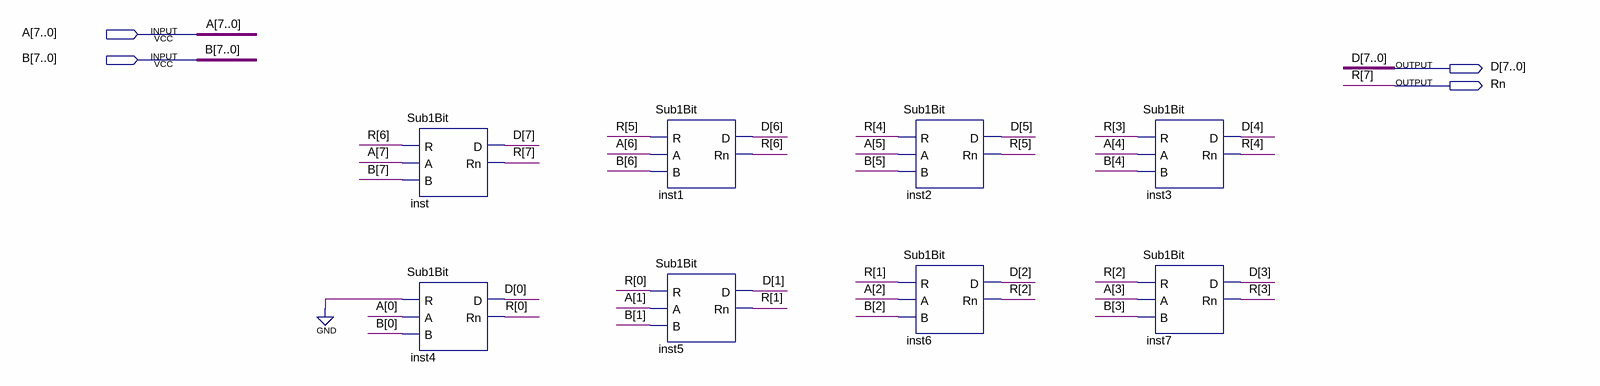
[diagram p0: schematic sheet]
// Quartus schematic SubnBit.bdf as structural Verilog: 8 symbols, 4 pins
module SubnBit (
  input  [7:0] A,
  input  [7:0] B,
  output [7:0] D,
  output Rn
);

  wire [6:0] R;

  Sub1Bit inst (.R(R[6]), .A(A[7]), .B(B[7]), .D(D[7]), .Rn(Rn));
  Sub1Bit inst4 (.R(1'b0), .A(A[0]), .B(B[0]), .D(D[0]), .Rn(R[0]));
  Sub1Bit inst1 (.R(R[5]), .A(A[6]), .B(B[6]), .D(D[6]), .Rn(R[6]));
  Sub1Bit inst5 (.R(R[0]), .A(A[1]), .B(B[1]), .D(D[1]), .Rn(R[1]));
  Sub1Bit inst2 (.R(R[4]), .A(A[5]), .B(B[5]), .D(D[5]), .Rn(R[5]));
  Sub1Bit inst6 (.R(R[1]), .A(A[2]), .B(B[2]), .D(D[2]), .Rn(R[2]));
  Sub1Bit inst3 (.R(R[3]), .A(A[4]), .B(B[4]), .D(D[4]), .Rn(R[4]));
  Sub1Bit inst7 (.R(R[2]), .A(A[3]), .B(B[3]), .D(D[3]), .Rn(R[3]));

  // Other names for the same wires on the sheet: R[7] = Rn
endmodule
